# EAGLE design EP Project (EAGLE 9.6.2)
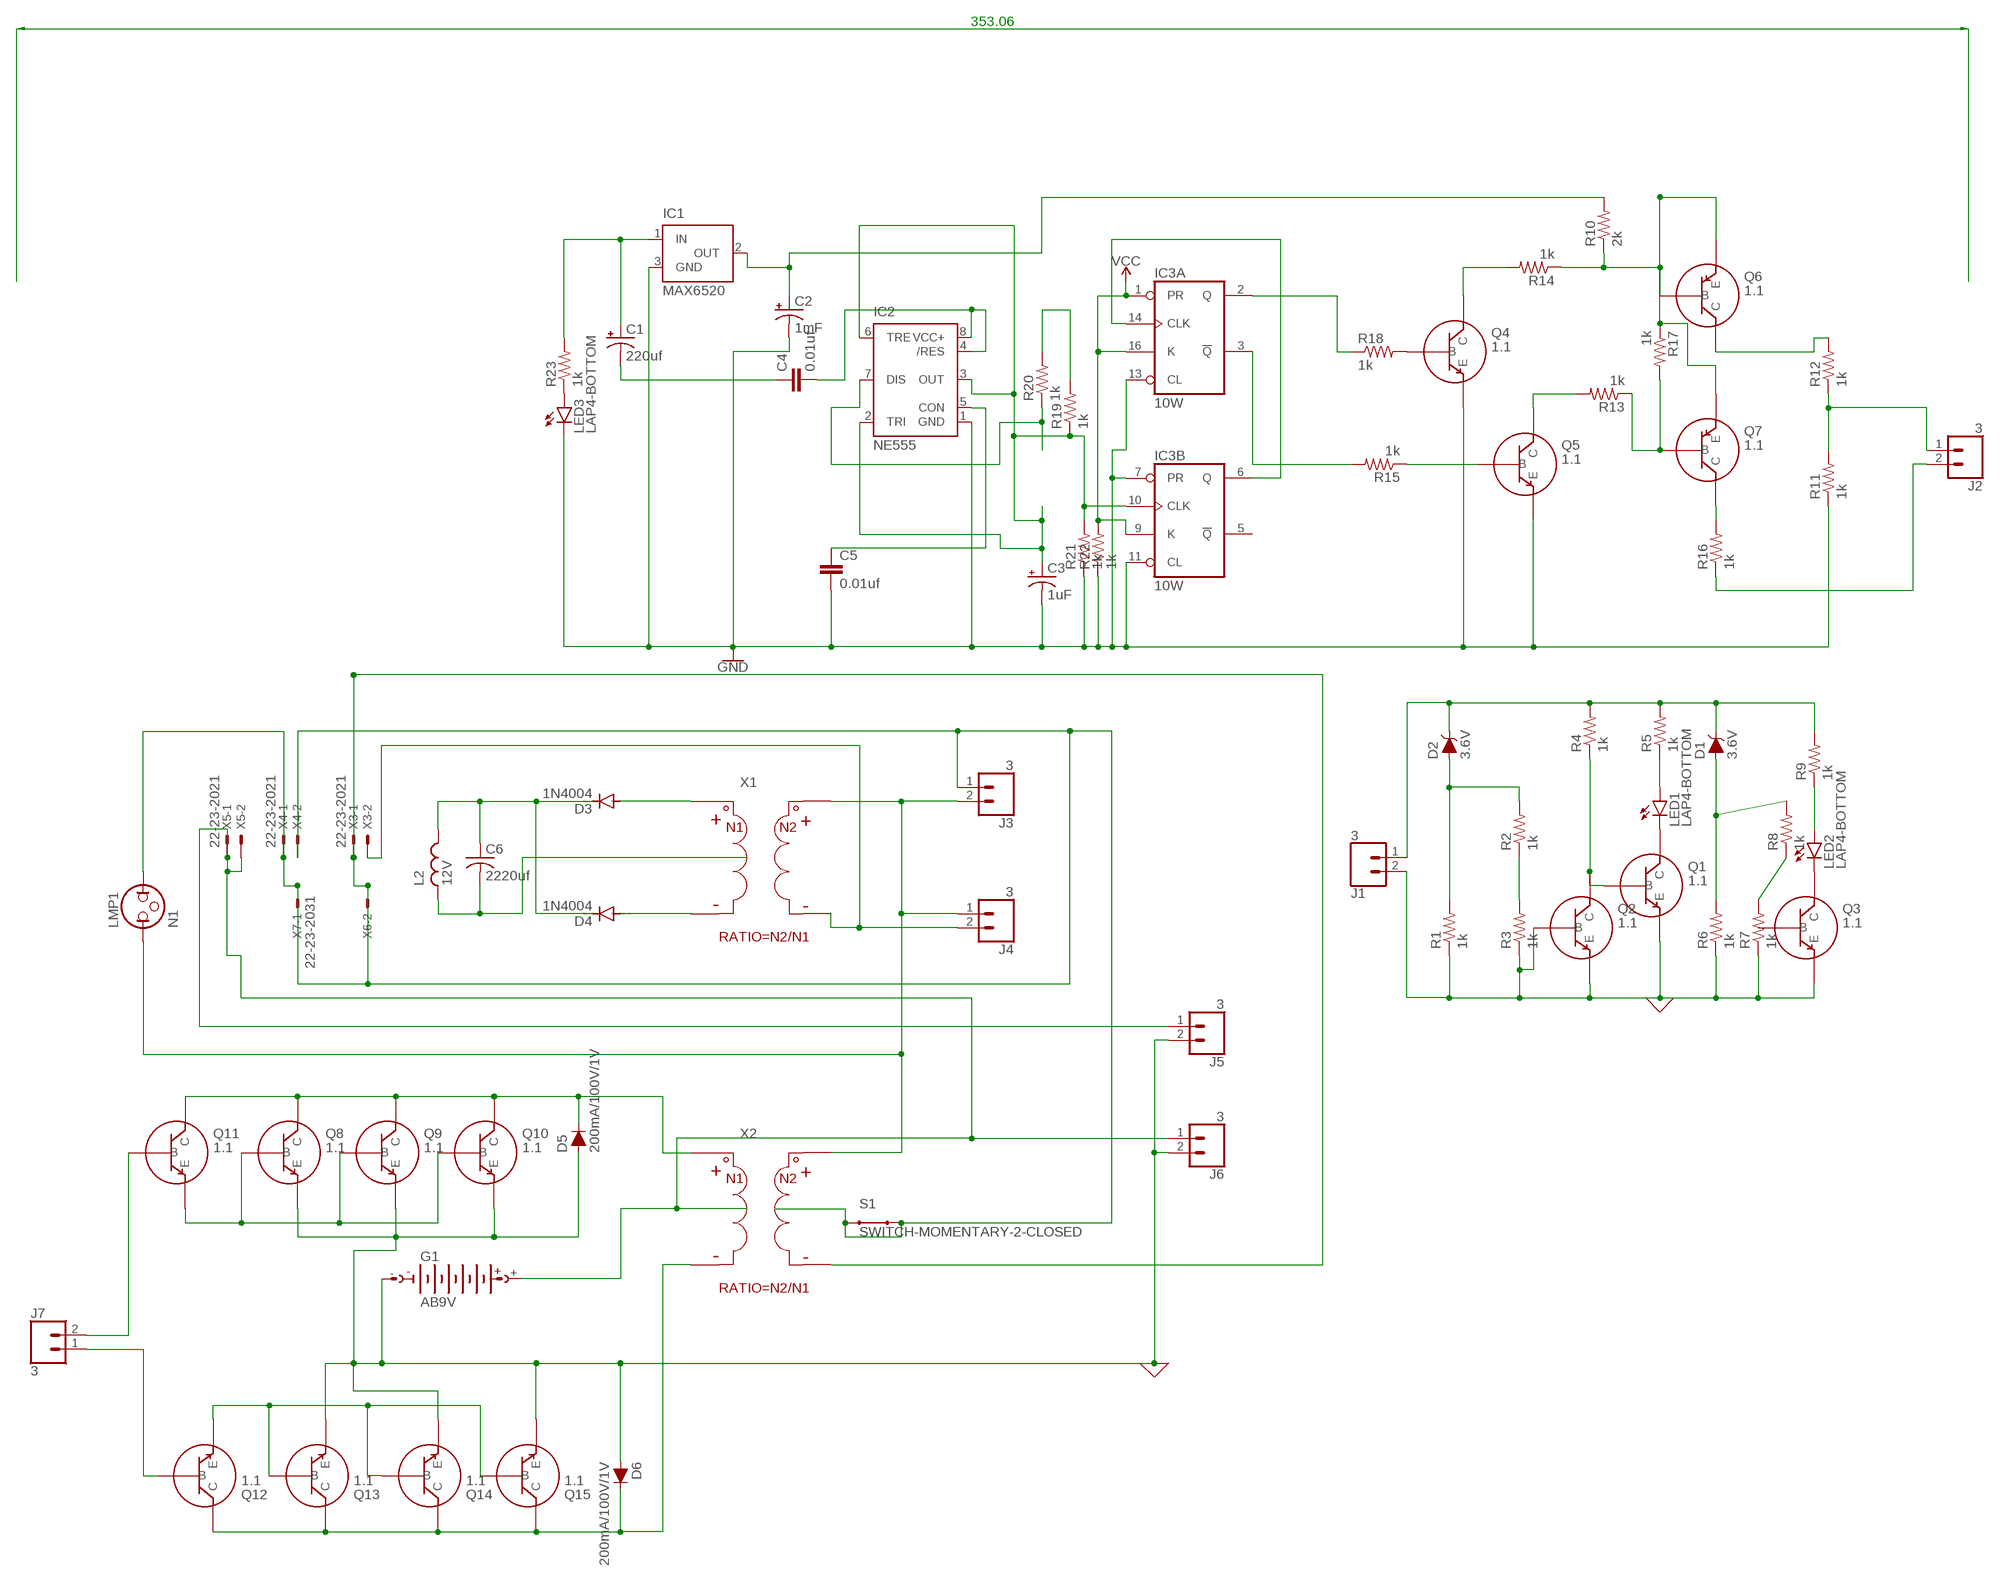
[diagram p0: schematic, sheet 1]

## Parts
C1  220uf  1000UF-RADIAL-5MM-25V-20%  [CPOL-RADIAL-5MM-10MM]
C2  1mF  1000UF-RADIAL-5MM-25V-20%  [CPOL-RADIAL-5MM-10MM]
C3  1uF  1000UF-RADIAL-5MM-25V-20%  [CPOL-RADIAL-5MM-10MM]
C4  0.01uf  10NF-0402T-25V-10%  [0402-TIGHT]
C5  0.01uf  10NF-0402T-25V-10%  [0402-TIGHT]
C6  2220uf  C-US025-024X044  [C025-024X044]
D1  3.6V  DIODE-ZENER-BZT52C3V6S  [SOD-323]
D2  3.6V  DIODE-ZENER-BZT52C3V6S  [SOD-323]
D3  1N4004  [DO41-10]
D4  1N4004  [DO41-10]
D5  200mA/100V/1V  DIODE-1N4148  [DIODE-1N4148]
D6  200mA/100V/1V  DIODE-1N4148  [DIODE-1N4148]
G1  AB9V  [AB9V]
IC1  MAX6520  [SOT23]
IC2  NE555  [DIL-08]
IC3  10W  74AC11112  [DIL16]
J1  3  CONN_02  [1X02]
J2  3  CONN_02  [1X02]
J3  3  CONN_02  [1X02]
J4  3  CONN_02  [1X02]
J5  3  CONN_02  [1X02]
J6  3  CONN_02  [1X02]
J7  3  CONN_02  [1X02]
L2  12V  L  (no package)
LED1  LAP4-BOTTOM  [P47F-BOTTOM]
LED2  LAP4-BOTTOM  [P47F-BOTTOM]
LED3  LAP4-BOTTOM  [P47F-BOTTOM]
LMP1  N1  NEON  [LDH-3R]
Q1  1.1  BJT_NPN  (no package)
Q2  1.1  BJT_NPN  (no package)
Q3  1.1  BJT_NPN  (no package)
Q4  1.1  BJT_NPN  (no package)
Q5  1.1  BJT_NPN  (no package)
Q6  1.1  BJT_PNP  (no package)
Q7  1.1  BJT_PNP  (no package)
Q8  1.1  BJT_NPN  (no package)
Q9  1.1  BJT_NPN  (no package)
Q10  1.1  BJT_NPN  (no package)
Q11  1.1  BJT_NPN  (no package)
Q12  1.1  BJT_NPN  (no package)
Q13  1.1  BJT_NPN  (no package)
Q14  1.1  BJT_NPN  (no package)
Q15  1.1  BJT_NPN  (no package)
R1  1k  R-US_0204/5  [0204/5]
R2  1k  R-US_0204/5  [0204/5]
R3  1k  R-US_0204/5  [0204/5]
R4  1k  R-US_0204/5  [0204/5]
R5  1k  R-US_0204/5  [0204/5]
R6  1k  R-US_0204/5  [0204/5]
R7  1k  R-US_0204/5  [0204/5]
R8  1k  R-US_0204/5  [0204/5]
R9  1k  R-US_0204/5  [0204/5]
R10  2k  R-US_0204/5  [0204/5]
R11  1k  R-US_0204/5  [0204/5]
R12  1k  R-US_0204/5  [0204/5]
R13  1k  R-US_0204/5  [0204/5]
R14  1k  R-US_0204/5  [0204/5]
R15  1k  R-US_0204/5  [0204/5]
R16  1k  R-US_0204/7  [0204/7]
R17  1k  R-US_0204/5  [0204/5]
R18  1k  R-US_0204/5  [0204/5]
R19  1k  R-US_0204/5  [0204/5]
R20  1k  R-US_0204/5  [0204/5]
R21  1k  R-US_0204/5  [0204/5]
R22  1k  R-US_0204/5  [0204/5]
R23  1k  R-US_0204/5  [0204/5]
S1  SWITCH-MOMENTARY-2-CLOSED  [TACTILE-PTH-12MM]
X1  TRANSFORMER  (no package)
X2  TRANSFORMER  (no package)
X3  22-23-2021  [22-23-2021]
X4  22-23-2021  [22-23-2021]
X5  22-23-2021  [22-23-2021]
X6  22-23-2031  [22-23-2031]
X7  22-23-2031  [22-23-2031]

## Nets
0: D5.A D6.A G1.- J1.2 J5.2 J6.2 Q1.E Q2.B Q2.E Q3.E Q8.E Q9.E Q10.E Q13.E Q14.E Q15.E R1.1 R3.1 R6.1 R7.1 ; supply symbol labelled GND
GND: C2.- C3.- C5.2 IC1.3(GND) IC2.1(GND) IC3.7(B:PR) IC3.11(B:CL) IC3.13(A:CL) LED3.C Q4.E Q5.E R11.1 R21.1 R22.1
N$1: D1.C D2.C J1.1 R4.2 R5.2 R9.2
N$2: LED1.C Q1.C
N$3: LED2.C Q3.C
N$4: Q1.B Q2.C R4.1
N$5: D2.A R1.2 R2.2
N$6: LED1.A R5.1
N$7: D1.A R6.2 R8.2
N$8: R7.2 R8.1
N$9: LED2.A R9.1
N$10: R2.1 R3.2
N$11: G1.+ J5.1 J6.1 X5.1 X5.2
N$12: C1.+ IC1.1(IN) R23.2
N$13: Q4.B R18.2
N$14: C5.1 IC2.5(CON)
N$15: C2.+ IC1.2(OUT) R10.2
N$16: C1.- C4.1
N$17: C4.2 IC2.4(/RES) IC2.8(VCC+)
N$18: R19.2 R20.2
N$19: D3.A X1.P$1
N$20: LED3.A R23.1
N$21: IC2.7(DIS) R20.1
N$22: C3.+ IC2.2(TRI) IC2.3(OUT) IC2.6(TRE) IC3.10(B:CLK) R19.1 R21.2
N$23: D4.A X1.P$2
N$24: Q6.B Q6.E Q7.E R10.1 R14.1 R17.1
N$25: IC3.6(B:Q) IC3.14(A:CLK)
N$26: C6.2 L2.1
N$27: C6.1 D3.C D4.C L2.2
N$28: IC3.2(A:Q) R18.1
N$29: IC3.3(A:!Q) R15.2
N$31: Q5.B R15.1
N$32: Q4.C R14.2
N$34: Q5.C R13.2
N$35: Q7.B R13.1 R17.2
N$36: Q8.B Q9.B Q10.B Q11.E
N$37: Q6.C R12.2
N$38: J2.1 R11.2 R12.1
N$39: Q7.C R16.2
N$40: J2.2 R16.1
N$42: J3.2 J4.1 LMP1.1 X1.P$3 X2.P$3
N$43: J4.2 X1.P$4 X3.2
N$45: D5.C Q8.C Q9.C Q10.C Q11.C X2.P$1
N$46: J3.1 LMP1.2 S1.1 S1.3 X2.P$4 X3.1 X4.1 X4.2 X6.2 X7.1
N$50: J7.2 Q11.B
N$51: J7.1 Q12.B
N$52: Q12.E Q13.B Q14.B Q15.B
N$54: D6.C Q12.C Q13.C Q14.C Q15.C X2.P$2
VCC: IC3.1(A:PR) IC3.9(B:K) IC3.16(A:K) R22.2
Unconnected: IC3.5(B:!Q) Q3.B X6.1 X6.3 X7.2 X7.3

## Power pins joined to a net without a drawn wire
GND: IC3.4(P:GND)
VCC: IC3.12(P:VCC)

## Library data of the parts
C1 C3 = SparkFun-Capacitors:1000UF: 1,000µF/1mF ceramic capacitors A capacitor is a passive two-terminal electrical component used to store electrical energy temporarily in an electric field. CAP-08070; PROD_ID: CAP-09538; VALUE: 1mF
C2 = SparkFun-Capacitors:1000UF: 1,000µF/1mF ceramic capacitors A capacitor is a passive two-terminal electrical component used to store electrical energy temporarily in an electric field. CAP-08070; PROD_ID: CAP-09538
C4 C5 = SparkFun-Capacitors:10NF: 0.01uF/10nF/10,000pF ceramic capacitors A capacitor is a passive two-terminal electrical component used to store electrical energy temporarily in an electric field. CAP-09321; PROD_ID: CAP-14847; VALUE: 10nF
C6 = rcl:C-US: CAPACITOR, American symbol; SPICEPREFIX: C
D1 D2 = SparkFun-DiscreteSemi:DIODE-ZENER: Zener Diode A Zener diode allows current to flow from its anode to its cathode like a normal semiconductor diode, but it also permits current to flow in the reverse direction when its "Zener voltage" is reached. - WIkipedia; PROD_ID: DIO-08199
D3 D4 = diode:1N4004: DIODE general purpose rectifier, 1 A
D5 D6 = SparkFun-DiscreteSemi:DIODE: Diode These are standard reverse protection diodes and small signal diodes. SparkFun Products: SparkFun SparkPunk Sound Kit <https://www.sparkfun.com/products/11177> SparkFun ESP8266 Thing <https://www.sparkfun.com/products/13231>; PROD_ID: DIO-08378
G1 = battery:AB9V: 9-V BATTERY CLIP
IC1 = maxim:MAX6520: 1.2V Voltage Reference 50ppm/°C, SOT23, 3-Terminal Source: Data sheet <http://datasheets.maxim-ic.com/en/ds/MAX6520.pdf>; MF: MAXIM; MPN: MAX6520EUR-T; OC_FARNELL: unknown; OC_NEWARK: 02J4586
IC2 = st-microelectronics:NE555: General purpose bipolar Timer; MF: Arrow Electronics; MPN: NE555N; OC_FARNELL: 1467742; OC_NEWARK: 89K1486
IC3 = 74ac-logic:74AC11112: Dual J-K negative edge triggered FLIP FLOP
J1-J7 = SparkFun-Connectors:CONN_02: Multi connection point. Often used as Generic Header-pin footprint for 0.1 inch spaced/style header connections On any of the 0.1 inch spaced packages, you can populate with these: Break Away Headers - Straight <https://www.sparkfun.com/products/116> (PRT-00116) Break Away Male Headers - Right Angle <https://www.sparkfun.com/products/553> (PRT-00553) Female Headers <https://www.sparkfun.com/products/115> (PRT-00115) Break Away Headers - Machine Pin <https://www.sparkfun.com/products/117> (PRT-00117) Break Away Female Headers - Swiss Machine Pin <https://www.sparkfun.com/products/743> (PRT-00743) For SCREWTERMINALS and SPRING TERMINALS visit here: Screw Terimnals on SparkFun.com <https://www.sparkfun.com/search/results?term=Screw+Terminals> (5mm/3.5mm/2.54mm spacing) This device is also useful as a general connection point to wire up your design to another part of your project. Our various solder wires solder well into these plated through hole pads. Hook-Up Wire - Assortment (Stranded, 22 AWG) <https://www.sparkfun.com/products/11375> (PRT-11375) Hook-Up Wire - Assortment (Solid Core, 22 AWG) <https://www.sparkfun.com/products/11367> (PRT-11367) View the entire wire category on our website here <https://www.sparkfun.com/categories/141> Special notes: Molex polarized connector foot print use with: PRT-08233 with associated crimp pins and housings. 2.54_SCREWTERM for use with PRT-10571. 3.5mm Screw Terminal footprints for PRT-08084 5mm Screw Terminal footprints for use with PRT-08432
L2 = ngspice-simulation:L: INDUCTOR
LED1-LED3 = led:*P4: PointLED® Enhanced Thinfilm LED TOP & BOTTOM mount LS P47F, LR P47F, LA P47F, LY P47F, LT P4SG, LB P4SG, LW P4SG Source: http://catalog.osram-os.com .. LA_LR_LS_LY_P47F_Pb_free.pdf
LMP1 = special:NEON: Neon LAMP
Q1-Q5 Q8-Q15 = ngspice-simulation:BJT_NPN: Bipolar NPN Transistor
Q6 Q7 = ngspice-simulation:BJT_PNP: Bipolar PNP Transistor
R1-R23 = rcl:R-US_: RESISTOR, American symbol; SPICEPREFIX: R
S1 = SparkFun-Retired:SWITCH-MOMENTARY-2-CLOSED: Closed Switch for tutorial schematics. Not intended for PCB design. Maps to 12mm tact switch, only because eagle won't place a part with no package defined. The ordinary SWITCH-MOMENTARY-2 is likely to be more useful for regular schematics.
X1 X2 = ngspice-simulation:TRANSFORMER: Coupled inductors The RATIO is defined in the schematic by using the text command and adding a line that says: .PARAM RATIO=x Where x is the turns ratio of the transformer
X3-X5 = con-molex:22-23-2021: .100" (2.54mm) Center Header - 2 Pin; MF: MOLEX; MPN: 22-23-2021; OC_FARNELL: 1462926; OC_NEWARK: 25C3832
X6 X7 = con-molex:22-23-2031: .100" (2.54mm) Center Header - 3 Pin; MF: MOLEX; MPN: 22-23-2031; OC_FARNELL: 1462950; OC_NEWARK: 30C0862

## Board
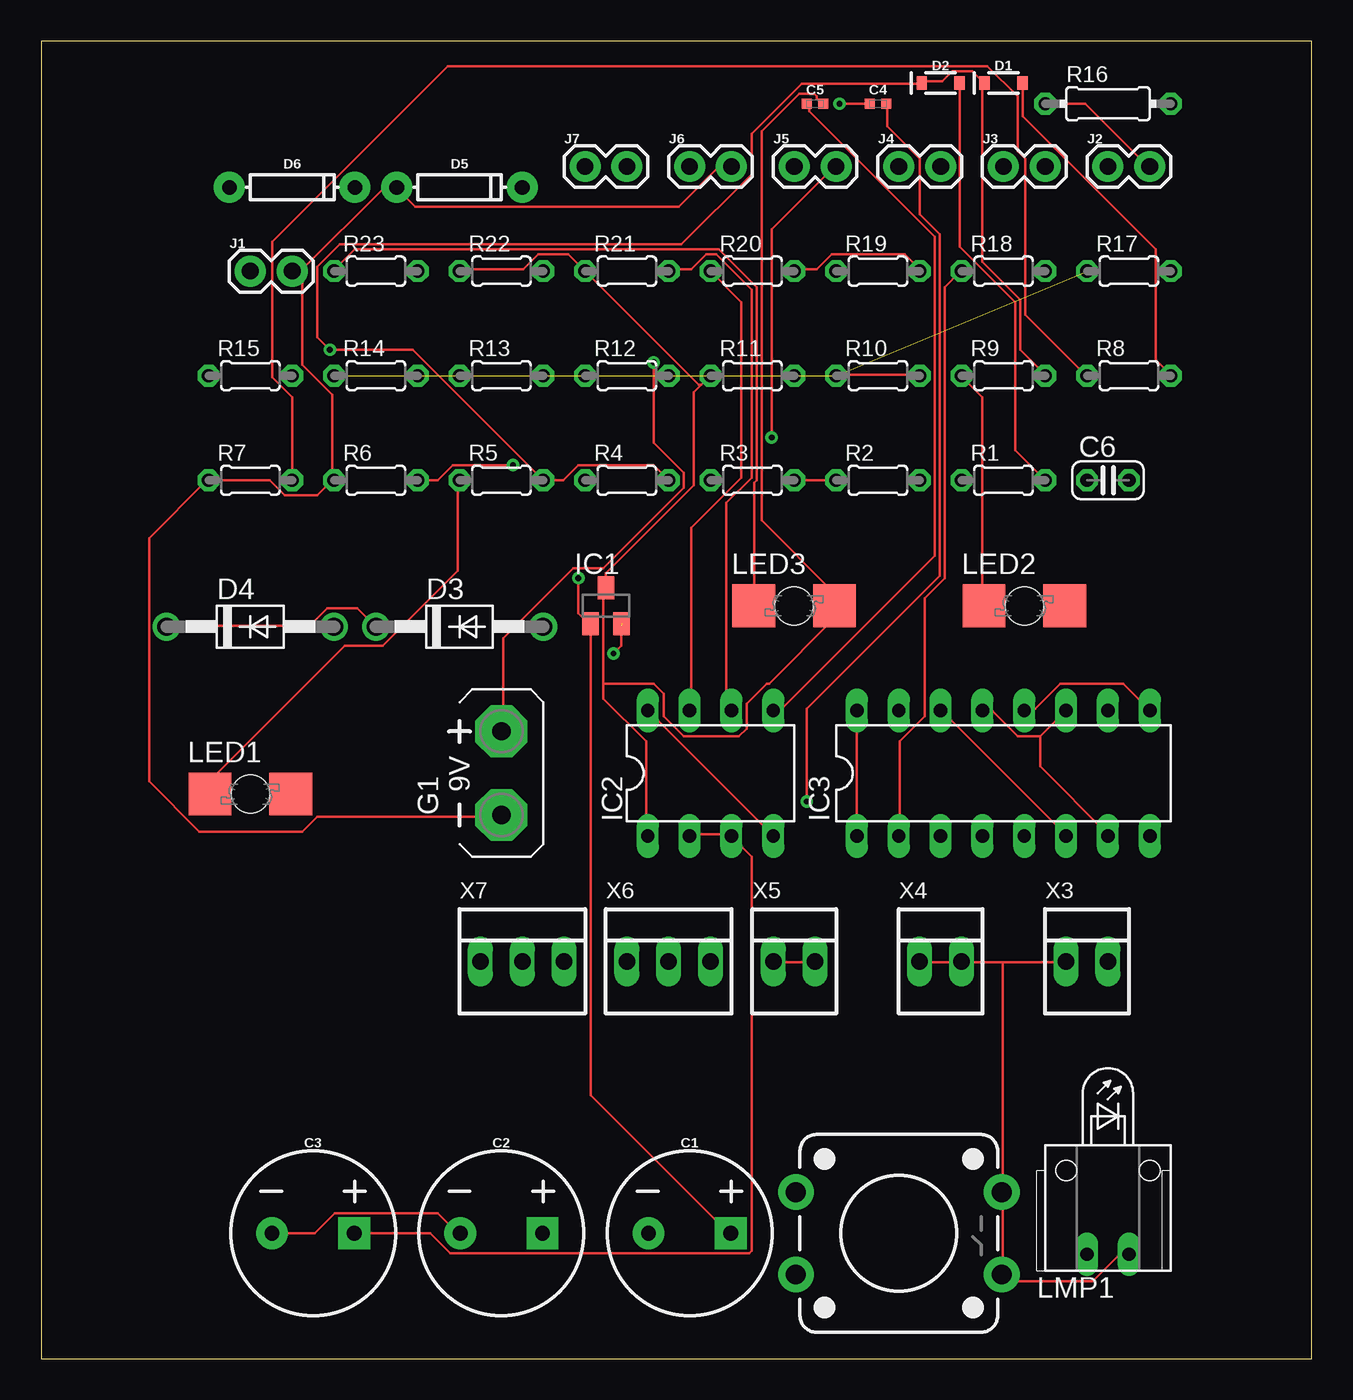
[diagram p1: board, top side]
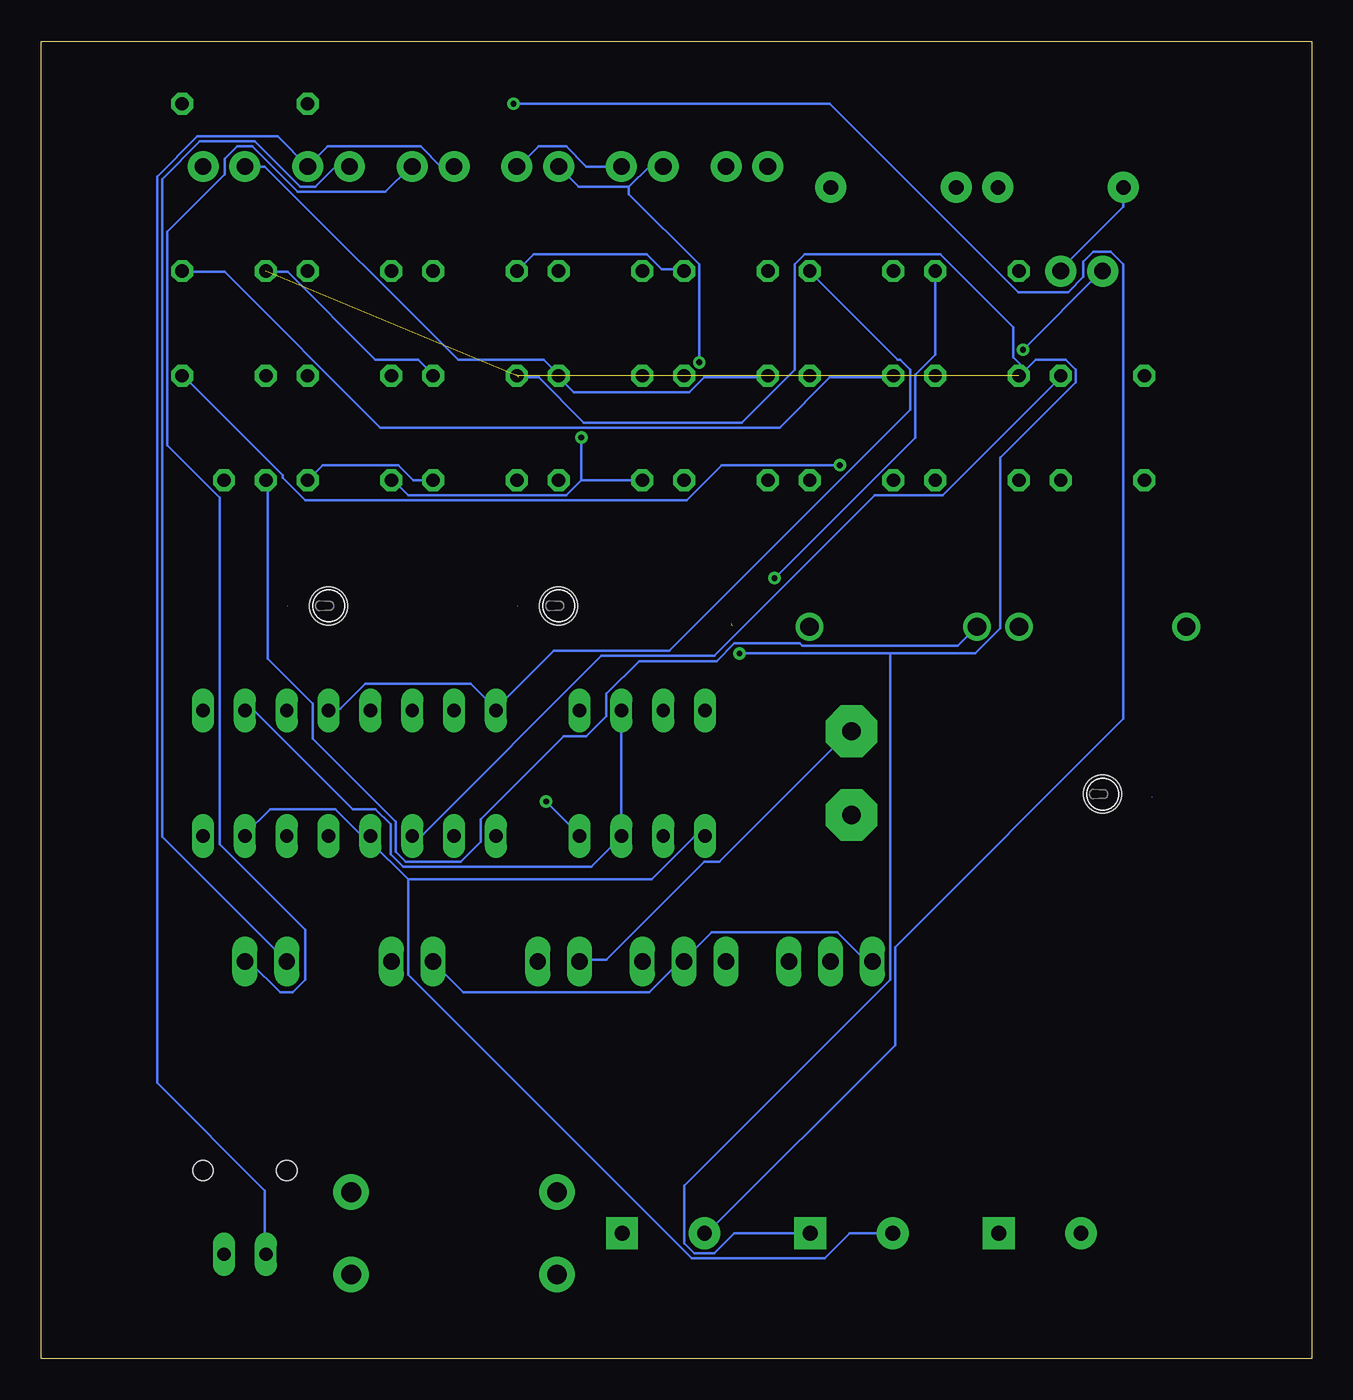
[diagram p2: board, bottom side, seen from below]

Size 77.14 x 80 mm. Coordinates in mm from the lower left corner, seen from the top.
Outline: 0,0 77.14,0 77.14,80 0,80 0,0
Copper layers (1*16): Top 0.035mm / dielectric 1.5mm / Bottom 0.035mm
Design rules "default": minimum track width 6mil, minimum drill 0.35mm, track to track 6mil, track to pad 6mil, pad to pad 6mil, via to via 6mil, smd to smd 6mil, copper to edge 40mil, drill to drill 6mil, minimum pad ring 10mil, minimum via ring 8mil, stop-mask expansion 4mil, vias tented up to drill 0mil, thermal gap 10mil

### Footprints (pad centres in the part's own frame; a part is rotated, then mirrored left to right if it is on the bottom)
CPOL-RADIAL-5MM-10MM = drill 0.9 pad 1.93 square: + 2.5,0 | drill 0.9 pad 1.93: - -2.5,0
0402-TIGHT = smd 0.6 x 0.6: 1 -0.5,0; 2 0.5,0
C025-024X044 = drill 0.813 octagon: 1 -1.27,0; 2 1.27,0
SOD-323 = smd 0.63 x 0.83: A 1.15,0; C -1.15,0
DO41-10 = drill 1.118: A 5.08,0; C -5.08,0
DIODE-1N4148 = drill 0.9 pad 1.88: A -3.81,0; C 3.81,0
AB9V = drill 1.118 pad 3.15 octagon: + 0,2.54; - 0,-2.54
SOT23 = smd 1 x 1.4: 1 -0.95,-1.1; 2 0.95,-1.1; 3 0,1.1
DIL-08 = drill 0.813 long: 1 -3.81,-3.81; 2 -1.27,-3.81; 3 1.27,-3.81; 4 3.81,-3.81; 5 3.81,3.81; 6 1.27,3.81; 7 -1.27,3.81; 8 -3.81,3.81
DIL16 = drill 0.813 long: 1 -8.89,-3.81; 2 -6.35,-3.81; 3 -3.81,-3.81; 4 -1.27,-3.81; 5 1.27,-3.81; 6 3.81,-3.81; 7 6.35,-3.81; 8 8.89,-3.81; 9 8.89,3.81; 10 6.35,3.81; 11 3.81,3.81; 12 1.27,3.81; 13 -1.27,3.81; 14 -3.81,3.81; 15 -6.35,3.81; 16 -8.89,3.81
1X02 = drill 1.016 pad 1.88: 1 0,0; 2 2.54,0
P47F-BOTTOM = smd 2.6 x 2.6: A -2.45,0; C 2.45,0 | hole 2.3: 0,0
LDH-3R = drill 0.813 long: 1 -1.27,-5.08; 2 1.27,-5.08 | hole 1.219: 2.54,0; -2.54,0
0204/5 = drill 0.813 octagon: 1 -2.54,0; 2 2.54,0
0204/7 = drill 0.813 octagon: 1 -3.81,0; 2 3.81,0
TACTILE-PTH-12MM = drill 1.2 pad 2.159: 1 6.25,-2.5; 2 -6.25,-2.5; 3 6.25,2.5; 4 -6.25,2.5
22-23-2021 = drill 1 long: 1 -1.27,0; 2 1.27,0
22-23-2031 = drill 1 long: 1 -2.54,0; 2 0,0; 3 2.54,0

### Placement (x,y rotation side)
C1  39.37,7.62 0 top
C2  27.94,7.62 0 top
C3  16.51,7.62 0 top
C4  50.8,76.2 0 top
C5  46.99,76.2 0 top
C6  64.77,53.34 0 top
D1  58.42,77.47 0 top
D2  54.61,77.47 0 top
D3  25.4,44.45 0 top
D4  12.7,44.45 0 top
D5  25.4,71.12 0 top
D6  15.24,71.12 0 top
G1  27.94,35.56 0 top
IC1  34.29,45.72 0 top
IC2  40.64,35.56 0 top
IC3  58.42,35.56 0 top
J1  12.7,66.04 0 top
J2  64.77,72.39 0 top
J3  58.42,72.39 0 top
J4  52.07,72.39 0 top
J5  45.72,72.39 0 top
J6  39.37,72.39 0 top
J7  33.02,72.39 0 top
LED1  12.7,34.29 0 top
LED2  59.69,45.72 0 top
LED3  45.72,45.72 0 top
LMP1  64.77,11.43 0 top
R1  58.42,53.34 0 top
R2  50.8,53.34 0 top
R3  43.18,53.34 0 top
R4  35.56,53.34 0 top
R5  27.94,53.34 0 top
R6  20.32,53.34 0 top
R7  12.7,53.34 0 top
R8  66.04,59.69 0 top
R9  58.42,59.69 0 top
R10  50.8,59.69 0 top
R11  43.18,59.69 0 top
R12  35.56,59.69 0 top
R13  27.94,59.69 0 top
R14  20.32,59.69 0 top
R15  12.7,59.69 0 top
R16  64.77,76.2 0 top
R17  66.04,66.04 0 top
R18  58.42,66.04 0 top
R19  50.8,66.04 0 top
R20  43.18,66.04 0 top
R21  35.56,66.04 0 top
R22  27.94,66.04 0 top
R23  20.32,66.04 0 top
S1  52.07,7.62 0 top
X3  63.5,24.13 0 top
X4  54.61,24.13 0 top
X5  45.72,24.13 0 top
X6  38.1,24.13 0 top
X7  29.21,24.13 0 top

### Tracks (layer width: path | path; a pad name or v marks a point on that pad's centre or on a via)
0  (via drill 0.35)
  Top 0.152: 17.68,53.34 16.76,52.43 14.78,52.43 13.87,53.34 R7.1 10.06,53.34 6.55,49.84 6.55,35.05 9.6,32 15.85,32 16.76,32.92 27.89,32.92 G1.- | 15.85,66.14 20.73,71.02 21.49,71.02 D5.A 21.64,71.02 22.71,69.95 38.71,69.95 41.15,72.39 J6.2 | 15.85,66.14 15.24,66.14 J1.2 15.85,66.14 | 17.68,53.34 17.68,58.52 15.85,60.35 15.85,66.14 | 17.68,53.34 R6.1 | v44.35,55.93 44.35,68.58 48.16,72.39 J5.2
  Bottom 0.152: 44.35,53.34 R3.1 | 44.35,53.34 45.26,52.43 54.86,52.43 55.78,53.34 R1.1 | J6.2 44.04,72.39 45.26,73.61 46.94,73.61 48.16,72.39 J5.2 | D6.A 11.43,69.95 15.24,66.14 J1.2 | v44.35,55.93 44.35,53.34
GND
  Top 0.152: 48.16,45.72 48.16,46.48 43.74,50.9 43.74,74.52 46.02,76.81 46.94,76.81 47.09,76.66 47.09,76.5 47.4,76.2 C5.2 | R22.1 25.45,66.14 29.26,66.14 30.18,67.06 32,67.06 R21.1 39.93,59.13 40.08,59.13 | R11.1 40.08,59.13 | 40.08,59.13 39.62,58.67 39.62,53.03 34.29,47.7 IC1.3 34.29,46.79 34.14,46.63 34.14,41 | 34.14,41 34.14,40.08 36.73,37.49 36.73,31.85 IC2.1 | 48.16,45.72 48.16,44.96 44.2,41 44.04,41 42.82,39.78 42.82,38.25 42.37,37.8 39.01,37.8 37.8,39.01 37.8,40.39 37.19,41 34.14,41 | 48.16,45.72 LED3.C | C3.- 16.61,7.62 17.83,8.84 24.08,8.84 25.3,7.62 C2.- | 60.66,37.8 59.28,37.8 57.76,39.32 57.15,39.32 IC3.13 | IC3.11 60.66,37.8 | 60.66,37.8 60.66,35.97 64.77,31.85 IC3.7
  Bottom 0.152: IC3.7 64.77,31.85 63.25,33.38 59.28,33.38 57.76,31.85 57.15,31.85 IC3.4 57.15,31.39 54.86,29.11 | C2.- 28.04,7.62 29.57,6.1 37.64,6.1 54.86,23.32 54.86,29.11 | 54.86,29.11 40.08,29.11 37.49,31.7 36.88,31.7 IC2.1
N$1  (via drill 0.35)
  Top 0.152: R9.2 60.96,59.74 59.44,61.27 59.44,64.31 57.15,66.6 57.15,77.42 D1.C 57.15,77.57 56.54,78.18 55.32,78.18 54.71,77.57 53.49,77.57 D2.C 53.34,77.42 46.18,77.42 43.13,74.37 43.13,71.93 38.86,67.67 18.14,67.67 16.76,66.29 16.76,62.03 v17.53,61.27 22.55,61.27 R5.2 31.7,53.34 32.61,54.25 37.19,54.25 R4.2
  Bottom 0.152: v17.53,61.27 12.8,65.99 J1.1
N$5
  Top 0.152: R1.2 59.13,55.17 59.13,64.16 55.78,67.51 55.78,77.42 D2.A
  Bottom 0.152: R2.2 54.56,53.34 55.47,54.25 60.05,54.25 R1.2
N$6
  Top 0.152: LED1.A 10.36,34.29 10.36,35.2 18.44,43.28 20.73,43.28 25.3,47.85 25.3,53.34 R5.1
N$7  (via drill 0.35)
  Top 0.152: D1.A 59.59,77.42 59.59,75.44 67.67,67.36 67.67,60.66 68.58,59.74 R8.2 | R6.2 24.08,53.34 24.99,54.25 v28.65,54.25
  Bottom 0.152: v28.65,54.25 35.81,54.25 37.95,52.12 61.11,52.12 62.48,53.49 62.48,53.65 68.58,59.74 R8.2
N$8
  Top 0.152: R7.2 15.24,58.37 14.02,59.59 14.02,67.82 24.69,78.49 57.45,78.49 59.28,76.66 59.28,73.3 59.74,72.85 59.74,63.4 63.4,59.74 R8.1
N$9
  Top 0.152: LED2.A 57.15,45.72 57.15,58.37 55.93,59.59 R9.1
N$10
  Top 0.152: R2.1 R3.2
N$11  (via drill 0.35)
  Top 0.152: X5.1 44.5,24.08 46.94,24.08 X5.2 | v37.19,60.5 37.19,55.63 39.01,53.8 39.01,52.88 34.14,48.01 32.31,48.01 28.04,43.74 28.04,38.1 G1.+
  Bottom 0.152: J6.1 40.23,72.39 41.45,71.17 | 41.45,71.17 44.5,71.17 J5.1 | X5.1 44.35,24.23 42.82,24.23 36.88,30.18 35.97,30.18 28.04,38.1 G1.+ | 41.45,71.17 41.45,70.71 37.19,66.45 v37.19,60.5
N$12  (via drill 0.35)
  Top 0.152: C1.+ 41.76,7.62 33.38,16 33.38,44.5 IC1.1 33.22,44.65 32.61,45.26 v32.61,47.4
  Bottom 0.152: R23.2 22.86,60.96 24.08,59.74 24.08,55.93 v32.61,47.4
N$14
  Top 0.152: C5.1 46.63,76.2 46.63,75.74 54.25,68.12 54.25,48.77 44.96,39.47 44.5,39.47 IC2.5
N$15  (via drill 0.35)  (2 unrouted)
  Top 0.152: 48.31,59.74 53.34,59.74 R10.2 | 35.2,44.5 35.2,43.28 v34.75,42.82
  Bottom 0.152: 63.4,65.99 62.18,65.99 56.84,60.66 54.25,60.66 53.34,59.74 R10.2 | 25.6,42.82 20.42,42.82 18.9,44.35 18.9,54.71 14.33,59.28 14.33,60.05 14.94,60.66 16.76,60.66 17.37,60.05 | 25.6,42.82 v34.75,42.82 | 17.68,59.74 17.37,60.05 | C2.+ 35.05,7.62 36.27,6.4 37.49,6.4 38.1,7.01 38.1,10.52 25.6,23.01 25.6,42.82 | 48.16,59.59 46.94,59.59 44.2,56.84 34.59,56.84 31.39,60.05 31.39,66.45 30.79,67.06 22.55,67.06 18.14,62.64 18.14,60.81 17.37,60.05
N$16  (via drill 0.35)
  Top 0.152: v48.46,76.2 C4.1
  Bottom 0.152: v48.46,76.2 29.26,76.2 17.83,64.77 14.78,64.77 13.87,65.68 13.87,66.6 13.26,67.21 12.19,67.21 11.43,66.45 11.43,38.86 25.3,24.99 25.3,19.05 36.73,7.62 C1.-
N$17  (via drill 0.35)
  Top 0.152: v46.48,33.83 46.48,39.47 54.56,47.55 54.56,68.28 53.34,69.49 53.34,72.85 51.36,74.83 51.36,76.2 C4.2 | IC2.4 IC2.8
  Bottom 0.152: v46.48,33.83 44.5,31.85 IC2.4
N$18
  Top 0.152: R20.2 45.72,66.14 47.09,66.14 48.01,67.06 52.43,67.06 53.34,66.14 R19.2
N$20
  Top 0.152: LED3.A 43.28,45.72 43.28,53.19 43.43,53.34 43.43,65.08 41.15,67.36 19.05,67.36 17.83,66.14 R23.1
N$21
  Top 0.152: R20.1 42.52,64.16 42.52,53.49 39.47,50.44 39.47,39.47 IC2.7
N$22
  Top 0.152: IC2.2 39.47,31.85 41.91,31.85 IC2.3 41.91,31.7 43.13,30.48 43.13,6.55 42.98,6.4 24.84,6.4 23.62,7.62 C3.+ | R21.2 38.1,66.14 39.47,66.14 40.39,67.06 41,67.06 43.13,64.92 43.13,53.49 41.6,51.97 41.6,39.78 41.91,39.47 IC2.6
  Bottom 0.152: R19.1 47.24,67.06 40.39,67.06 39.47,66.14 38.1,66.14 R21.2 | IC2.6 IC2.3 41.91,31.7 43.74,29.87 55.17,29.87 55.93,30.63 55.93,32.46 56.84,33.38 58.22,33.38 64.16,39.32 64.77,39.32 IC3.10
N$24  (2 unrouted)
N$25
  Top 0.152: IC3.14 54.71,39.32 62.18,31.85 IC3.6
N$27
  Top 0.152: D3.C 19.2,45.57 17.37,45.57 16.31,44.5 7.62,44.5 D4.C
  Bottom 0.152: D3.C 21.49,43.28 30.94,43.28 31.09,43.43 35.05,43.43 36.12,42.37 40.84,42.37 42.82,40.39 42.82,39.01 44.04,37.8 45.41,37.8 50.44,32.77 50.44,31.39 51.66,30.18 55.02,30.18 55.63,30.79 55.63,32.61 60.66,37.64 60.66,39.78 63.4,42.52 63.4,53.34 C6.1
N$28
  Top 0.152: IC3.2 52.12,31.85 52.12,37.49 53.65,39.01 53.65,46.18 54.86,47.4 54.86,65.08 55.78,65.99 R18.1
N$29
  Bottom 0.152: IC3.3 54.56,31.85 53.95,31.85 43.13,42.67 36.27,42.67 26.52,52.43 22.4,52.43 15.24,59.59 R15.2
N$35
  Bottom 0.152: R13.1 25.45,59.59 29.26,59.59 32.31,56.54 56.54,56.54 65.99,65.99 68.58,65.99 R17.2
N$38
  Bottom 0.152: R12.1 33.07,59.59 36.88,59.59 37.8,58.67 44.81,58.67 45.72,59.59 R11.2 45.72,59.74 46.63,60.66 51.82,60.66 63.55,72.39 J2.1
N$40
  Top 0.152: R16.1 63.4,76.2 67.21,72.39 J2.2
N$42
  Bottom 0.152: LMP1.1 63.55,6.4 63.55,10.21 70.1,16.76 70.1,71.78 67.67,74.22 62.79,74.22 J3.2 59.74,73.61 54.1,73.61 52.88,72.39 J4.1
N$43
  Bottom 0.152: X3.2 64.77,24.08 64.47,24.08 62.64,22.25 61.87,22.25 61.11,23.01 61.11,26.06 66.29,31.24 66.29,52.27 69.49,55.47 69.49,68.43 65.99,71.93 65.99,72.85 65.23,73.61 64.31,73.61 61.57,70.87 56.24,70.87 54.71,72.39 J4.2
N$46
  Top 0.152: LMP1.2 65.99,6.25 65.38,6.25 63.86,4.72 58.67,4.72 58.37,5.03 S1.1 58.37,5.18 58.37,10.06 S1.3 58.37,10.21 58.37,24.08 | X4.1 53.34,24.08 55.78,24.08 X4.2 55.93,24.08 58.37,24.08 | 58.37,24.08 62.18,24.08 X3.1
  Bottom 0.152: X7.1 26.67,24.23 27.13,24.23 28.8,25.91 36.42,25.91 38.1,24.23 X6.2 38.1,24.08 38.41,24.08 40.23,22.25 51.51,22.25 53.34,24.08 X4.1 | J3.1 59.28,72.39 60.5,71.17 61.42,71.17 64.16,73.91 67.51,73.91 69.8,71.63 69.8,31.7 X3.1
VCC
  Top 0.152: IC3.9 65.68,41 61.87,41 60.35,39.47 59.74,39.47 IC3.12 | IC3.16 IC3.1
  Bottom 0.152: 49.53,39.47 46.02,42.98 39.01,42.98 24.38,57.61 24.38,60.05 24.99,60.66 25.15,60.66 30.48,65.99 R22.2 | 49.53,39.47 51.05,41 57.45,41 58.98,39.47 59.59,39.47 IC3.12 | 49.53,39.47 IC3.16